# EAGLE design Pinduino-Nano-Sys11b (EAGLE 7.7.0)
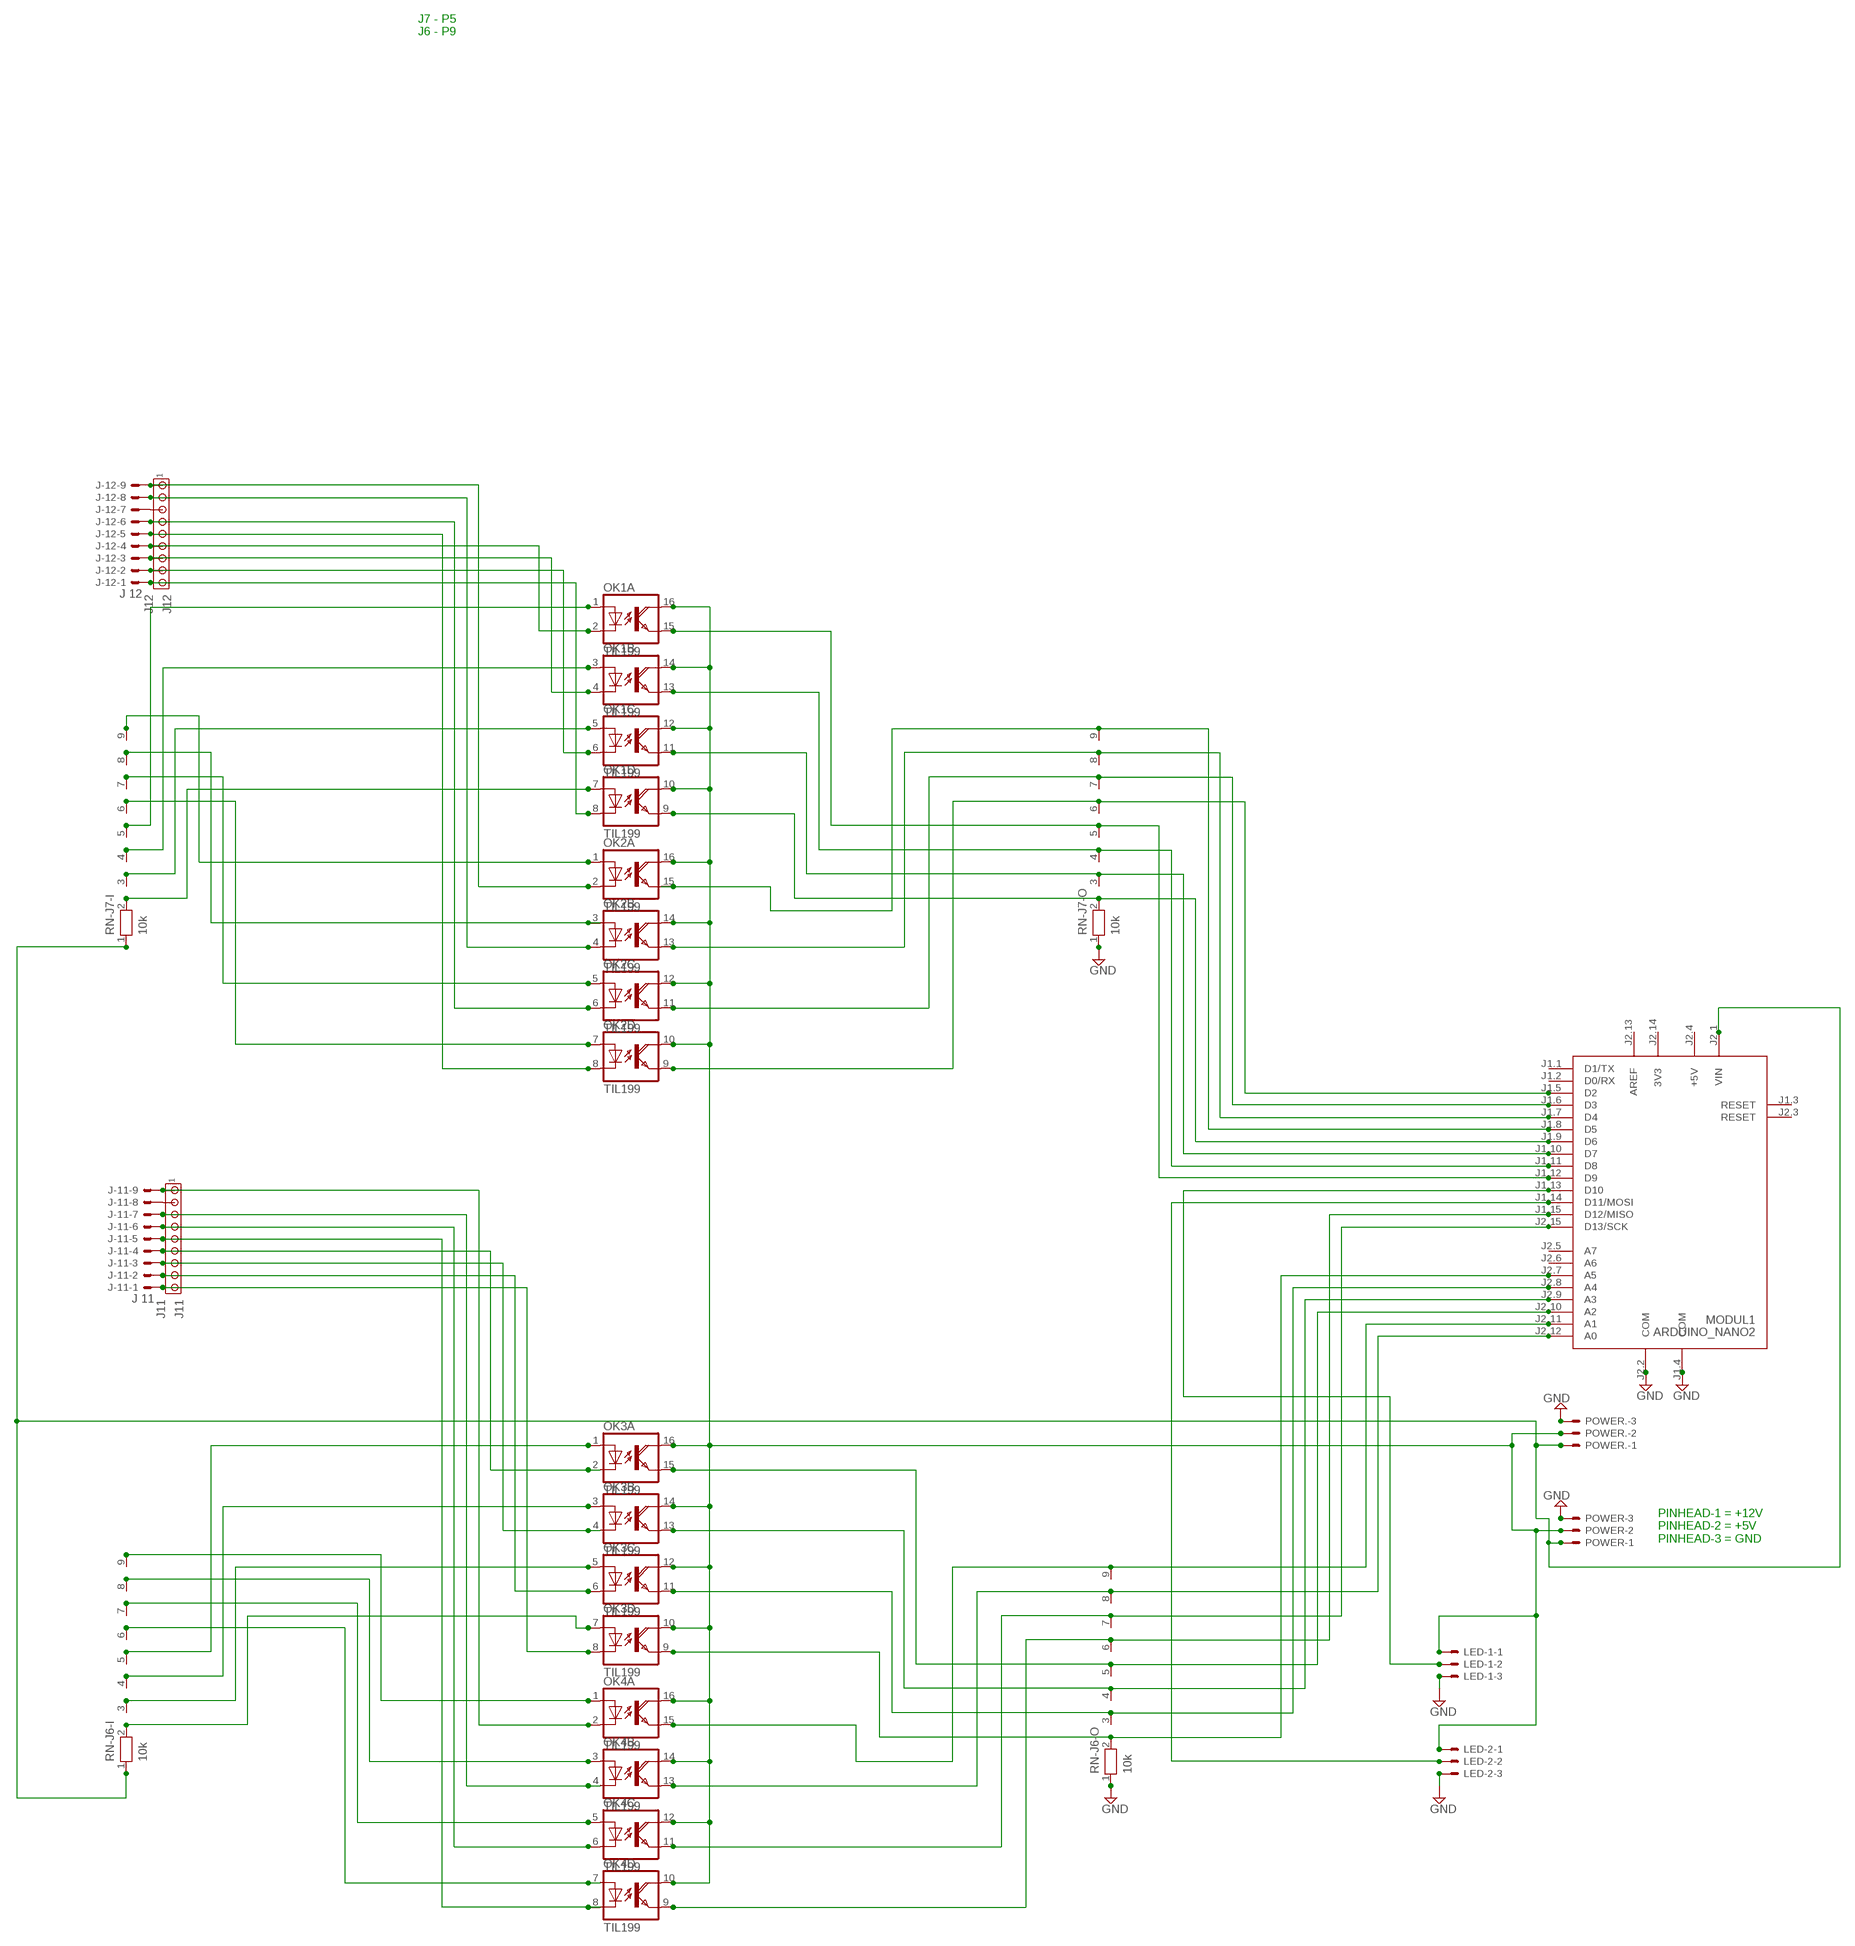
[diagram p0: schematic, sheet 1]

## Parts
J11  J11  MTA09-156  [1X9MTA]
J12  J12  MTA09-156  [1X9MTA]
J-11  J 11  KK-156-9  [KK-156-9]
J-12  J 12  KK-156-9  [KK-156-9]
LED-1  22-23-2031  [22-23-2031]
LED-2  22-23-2031  [22-23-2031]
MODUL1  ARDUINO_NANO2  [ARDUINO_NANO2]
OK1  TIL199  [DIL16]
OK2  TIL199  [DIL16]
OK3  TIL199  [DIL16]
OK4  TIL199  [DIL16]
POWER  22-23-2031  [22-23-2031]
POWER.  22-23-2031  [22-23-2031]
RN-J6-I  10k  RN08  [RN-9]
RN-J6-O  10k  RN08  [RN-9]
RN-J7-I  10k  RN08  [RN-9]
RN-J7-O  10k  RN08  [RN-9]

## Nets
ARD+5V [Power]: LED-1.1 LED-2.1 OK1.10(D:COL) OK1.12(C:COL) OK1.14(B:COL) OK1.16(A:COL) OK2.10(D:COL) OK2.12(C:COL) OK2.14(B:COL) OK2.16(A:COL) OK3.10(D:COL) OK3.12(C:COL) OK3.14(B:COL) OK3.16(A:COL) OK4.10(D:COL) OK4.12(C:COL) OK4.14(B:COL) OK4.16(A:COL) POWER.2 POWER..2
GND: LED-1.3 LED-2.3 MODUL1.J1.4(COM) MODUL1.J2.2(COM) POWER.3 POWER..3 RN-J6-O.1 RN-J7-O.1
N$1: J12.6 J-12.4 OK1.2(A:C)
N$2: MODUL1.J1.9(D6) OK1.9(D:EMI) RN-J7-O.2
N$3: OK1.3(B:A) RN-J7-I.4
N$4: OK1.5(C:A) RN-J7-I.3
N$5: OK1.7(D:A) RN-J7-I.2
N$6: OK2.1(A:A) RN-J7-I.9
N$7: OK2.3(B:A) RN-J7-I.8
N$8: OK2.5(C:A) RN-J7-I.7
N$9: OK1.1(A:A) RN-J7-I.5
N$10: J12.9 J-12.1 OK1.8(D:C)
N$11: J12.8 J-12.2 OK1.6(C:C)
N$12: J12.7 J-12.3 OK1.4(B:C)
N$13: OK2.7(D:A) RN-J7-I.6
N$14: J12.5 J-12.5 OK2.8(D:C)
N$15: J11.9 J-11.1 OK3.8(D:C)
N$16: J12.2 J-12.8 OK2.4(B:C)
N$17: J12.1 J-12.9 OK2.2(A:C)
N$18: MODUL1.J1.10(D7) OK1.11(C:EMI) RN-J7-O.3
N$19: J11.7 J-11.3 OK3.4(B:C)
N$20: J11.5 J-11.5 OK4.8(D:C)
N$21: J11.4 J-11.6 OK4.6(C:C)
N$22: J11.3 J-11.7 OK4.4(B:C)
N$23: J12.3 J-12.7
N$25: J11.2 J-11.8
N$26: MODUL1.J2.11(A1) OK4.15(A:EMI) RN-J6-O.9
N$27: J11.1 J-11.9 OK4.2(A:C)
N$29: OK4.1(A:A) RN-J6-I.9
N$30: OK4.3(B:A) RN-J6-I.8
N$31: OK4.5(C:A) RN-J6-I.7
N$32: OK3.3(B:A) RN-J6-I.4
N$33: OK3.1(A:A) RN-J6-I.5
N$34: OK3.5(C:A) RN-J6-I.3
N$35: OK4.7(D:A) RN-J6-I.6
N$37: OK3.7(D:A) RN-J6-I.2
N$38: MODUL1.J1.8(D5) OK2.15(A:EMI) RN-J7-O.9
N$39: MODUL1.J1.11(D8) OK1.13(B:EMI) RN-J7-O.4
N$40: J11.8 J-11.2 OK3.6(C:C)
N$41: MODUL1.J1.12(D9) OK1.15(A:EMI) RN-J7-O.5
N$42: MODUL1.J2.9(A3) OK3.13(B:EMI) RN-J6-O.4
N$43: MODUL1.J1.5(D2) OK2.9(D:EMI) RN-J7-O.6
N$44: LED-2.2 MODUL1.J1.14(D11/MOSI)
N$45: LED-1.2 MODUL1.J1.13(D10)
N$47: J12.4 J-12.6 OK2.6(C:C)
N$48: J11.6 J-11.4 OK3.2(A:C)
N$50: MODUL1.J2.15(D13/SCK) OK4.11(C:EMI) RN-J6-O.7
N$52: MODUL1.J1.15(D12/MISO) OK4.9(D:EMI) RN-J6-O.6
N$53: MODUL1.J2.10(A2) OK3.15(A:EMI) RN-J6-O.5
N$55: MODUL1.J2.12(A0) OK4.13(B:EMI) RN-J6-O.8
N$56: MODUL1.J1.6(D3) OK2.11(C:EMI) RN-J7-O.7
N$57: MODUL1.J1.7(D4) OK2.13(B:EMI) RN-J7-O.8
N$58: MODUL1.J2.8(A4) OK3.11(C:EMI) RN-J6-O.3
N$59: MODUL1.J2.7(A5) OK3.9(D:EMI) RN-J6-O.2
N$61 [GND]: MODUL1.J2.1(VIN) POWER.1 POWER..1 RN-J6-I.1 RN-J7-I.1
Unconnected: MODUL1.J1.1(D1/TX) MODUL1.J1.2(D0/RX) MODUL1.J1.3(RESET) MODUL1.J2.3(RESET) MODUL1.J2.5(A7) MODUL1.J2.6(A6)

## Notes on the sheet
- J7 - P5
  J6 - P9
- PINHEAD-1 = +12V
  PINHEAD-2 = +5V
  PINHEAD-3 = GND

## Power pins joined to a net without a drawn wire
3V3: MODUL1.J2.14(3V3)
+5V: MODUL1.J2.4(+5V)
AREF: MODUL1.J2.13(AREF)

## Library data of the parts
J11 J12 = con-amp:MTA09-156: AMP connector
J-11 J-12 = con-molex:KK-156-9: KK 156 HEADER Source: http://www.molex.com/pdm_docs/sd/026604100_sd.pdf; OC_FARNELL: unknown; OC_NEWARK: unknown
LED-1 LED-2 POWER POWER. = con-molex:22-23-2031: .100" (2.54mm) Center Header - 3 Pin; MF: MOLEX; MPN: 22-23-2031; OC_FARNELL: 1462950; OC_NEWARK: 30C0862
MODUL1 = arduino:ARDUINO_NANO2: Arduino Nano2 Auto generated by modulcreator.ulp \;; ANZAHL: 2; MODUL: TRUE; STECKX0: -76200; STECKX1: 76200; STECKY0: 177800; STECKY1: 177800
OK1-OK4 = optocoupler:TIL199: TEXAS INSTRUMENTS OPTO COUPLER; MPN: TIL 199; OC_FARNELL: 1683370; OC_NEWARK: 05R6483
RN-J6-I RN-J6-O RN-J7-I RN-J7-O = resistor-net:RN08: RESISTOR NETWORK; OC_FARNELL: unknown; OC_NEWARK: unknown

## Net classes
0 default: width 0.406 mm
1 Power: width 0.61 mm
2 GND: width 0.61 mm

## Board
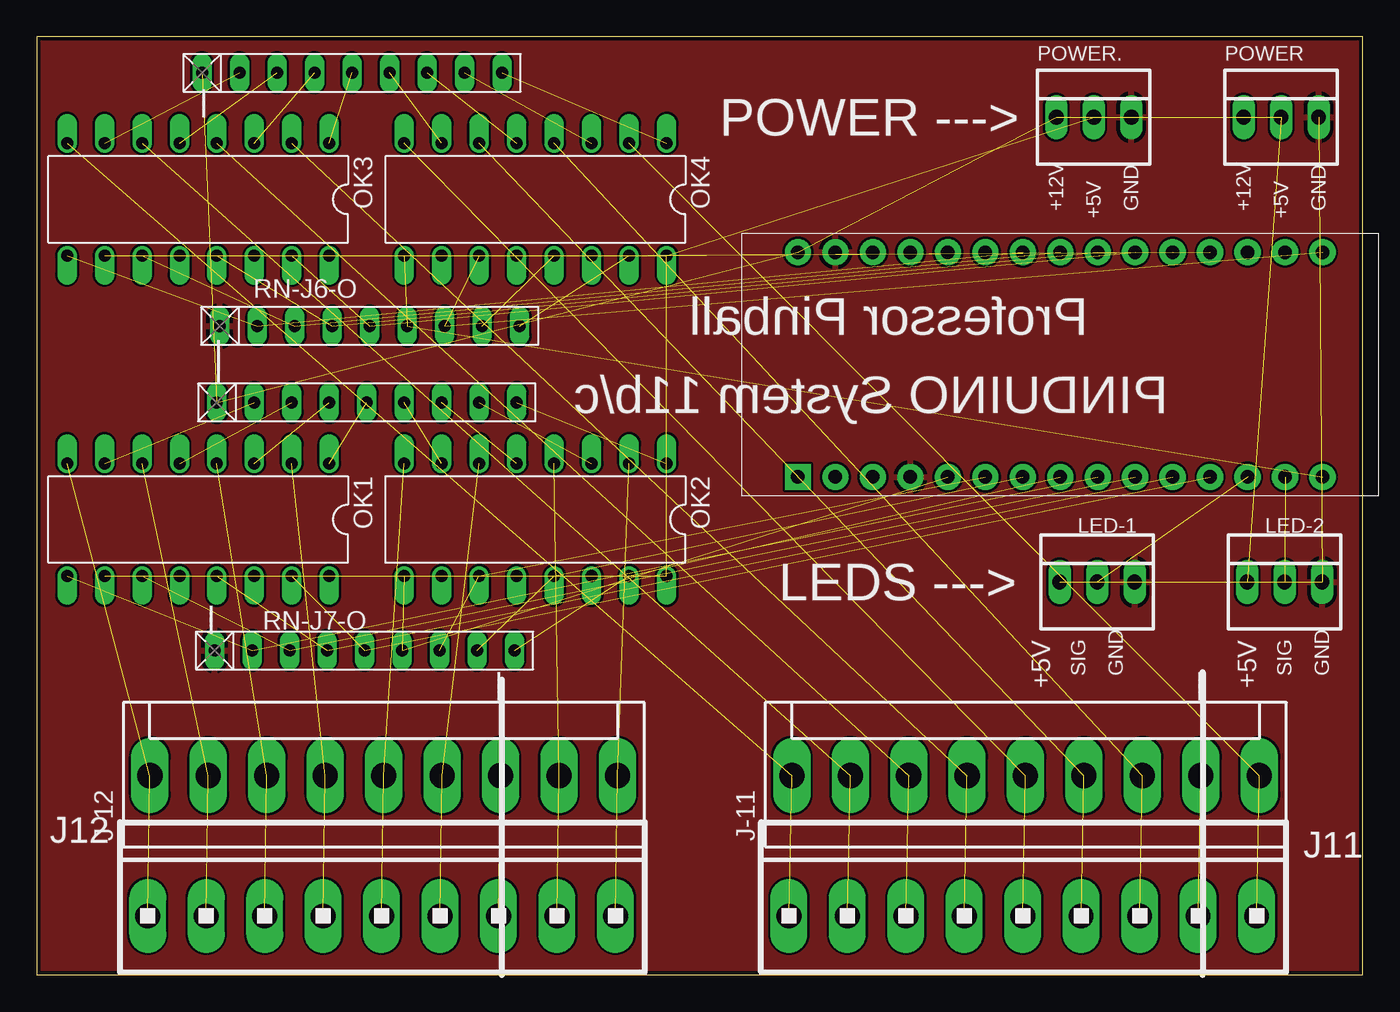
[diagram p1: board, top side]
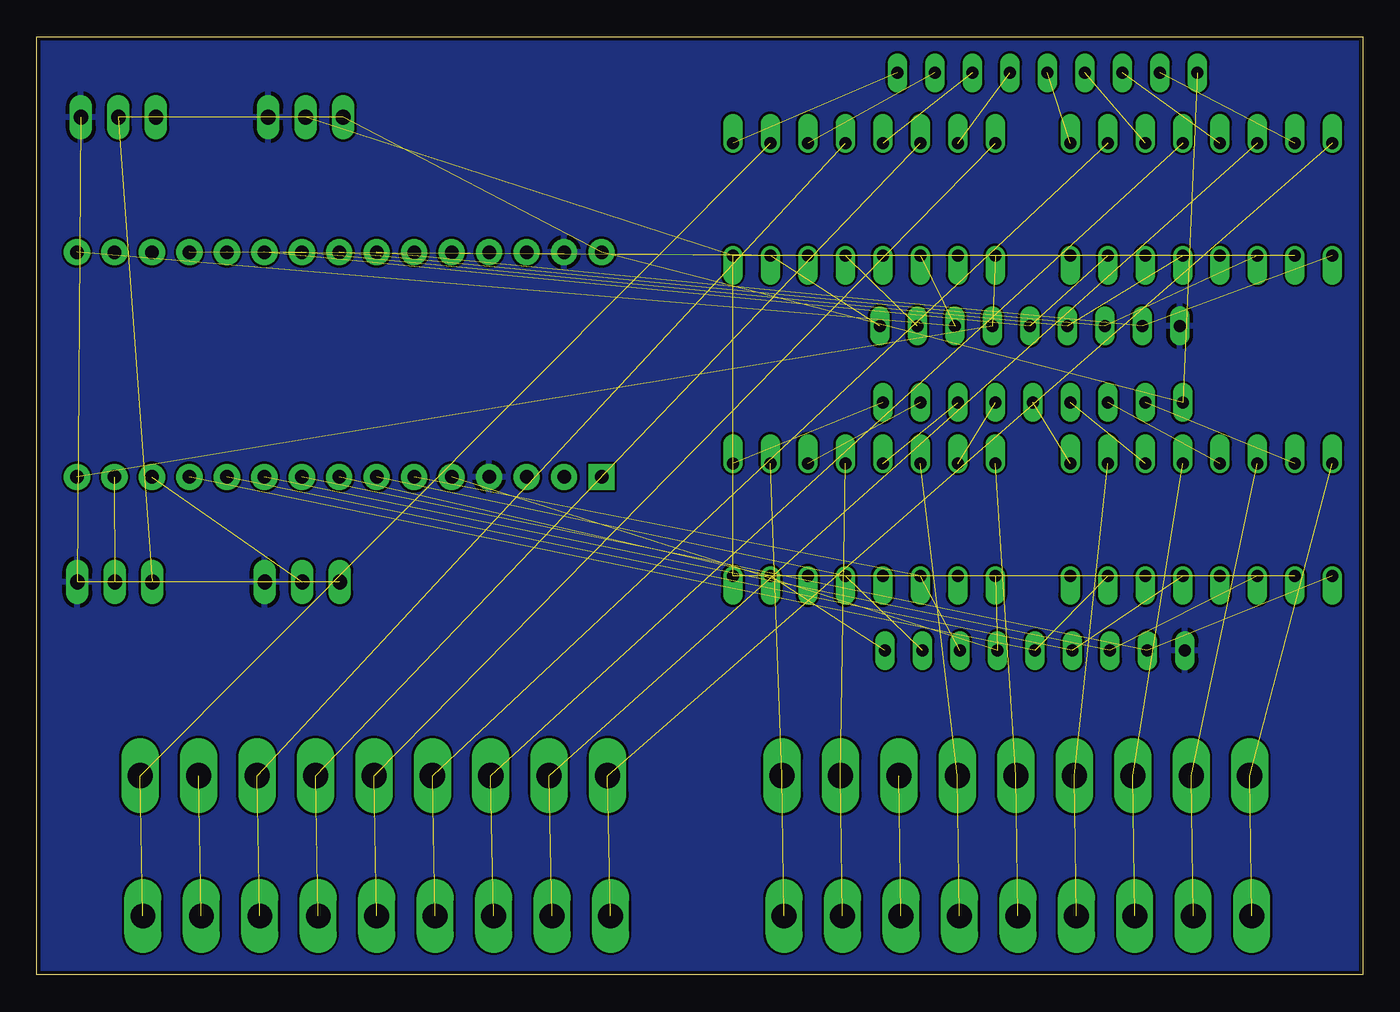
[diagram p2: board, bottom side, seen from below]

Size 89.84 x 63.57 mm. Coordinates in mm from the lower left corner, seen from the top.
Outline: 0,0 89.84,0 89.84,63.57 0,63.57 0,0
Copper layers (1*16): Top 0.035mm / dielectric 1.5mm / Bottom 0.035mm
Design rules "SeeedStudio_2layer_DRU_no_angle_20140221": minimum track width 6mil, minimum drill 12mil, track to track 6mil, track to pad 6mil, pad to pad 6mil, via to via 6mil, smd to smd 0mil, copper to edge 10mil, drill to drill 10mil, minimum pad ring 10mil, minimum via ring 6mil, stop-mask expansion 2mil, vias tented up to drill 100mil, thermal gap 10mil

### Footprints (pad centres in the part's own frame; a part is rotated, then mirrored left to right if it is on the bottom)
1X9MTA = drill 1.676 long: 1 15.85,0; 2 11.887,0; 3 7.925,0; 4 3.962,0; 5 0,0; 6 -3.962,0; 7 -7.925,0; 8 -11.887,0; 9 -15.85,0
KK-156-9 = drill 1.7 pad 2.184 long: 1 -15.84,0; 2 -11.88,0; 3 -7.92,0; 4 -3.96,0; 5 0,0; 6 3.96,0; 7 7.92,0; 8 11.88,0; 9 15.84,0
22-23-2031 = drill 1 long: 1 -2.54,0; 2 0,0; 3 2.54,0
ARDUINO_NANO2 = drill 0.914 pad 1.778 square: J1.1 -7.62,17.78 | drill 0.914 pad 1.778: J1.2 -7.62,15.24; J1.3 -7.62,12.7; J1.4 -7.62,10.16; J1.5 -7.62,7.62; J1.6 -7.62,5.08; J1.7 -7.62,2.54; J1.8 -7.62,0; J1.9 -7.62,-2.54; J1.10 -7.62,-5.08; J1.11 -7.62,-7.62; J1.12 -7.62,-10.16; J1.13 -7.62,-12.7; J1.14 -7.62,-15.24; J1.15 -7.62,-17.78; J2.1 7.62,17.78; J2.2 7.62,15.24; J2.3 7.62,12.7; J2.4 7.62,10.16; J2.5 7.62,7.62; J2.6 7.62,5.08; J2.7 7.62,2.54; J2.8 7.62,0; J2.9 7.62,-2.54; J2.10 7.62,-5.08; J2.11 7.62,-7.62; J2.12 7.62,-10.16; J2.13 7.62,-12.7; J2.14 7.62,-15.24; J2.15 7.62,-17.78
DIL16 = drill 0.813 offset: 1 -8.89,-3.81; 2 -6.35,-3.81; 3 -3.81,-3.81; 4 -1.27,-3.81; 5 1.27,-3.81; 6 3.81,-3.81; 7 6.35,-3.81; 8 8.89,-3.81; 9 8.89,3.81; 10 6.35,3.81; 11 3.81,3.81; 12 1.27,3.81; 13 -1.27,3.81; 14 -3.81,3.81; 15 -6.35,3.81; 16 -8.89,3.81
RN-9 = drill 0.813 long: 1 -10.16,0; 2 -7.62,0; 3 -5.08,0; 4 -2.54,0; 5 0,0; 6 2.54,0; 7 5.08,0; 8 7.62,0; 9 10.16,0

### Placement (x,y rotation side)
J11  66.81,3.99 0 top
J12  23.36,3.99 0 top
J-11  67,13.5 0 top
J-12  23.5,13.5 0 top
LED-1  71.85,26.62 0 top
LED-2  84.55,26.62 0 top
MODUL1  69.35,41.36 90 top
OK1  10.93,30.86 180 top
OK2  33.79,30.86 180 top
OK3  10.93,52.56 180 top
OK4  33.79,52.56 180 top
POWER  84.32,58.12 0 top
POWER.  71.62,58.12 0 top
RN-J6-I  21.35,61.14 0 top
RN-J6-O  22.56,43.97 0 top
RN-J7-I  22.35,38.79 0 top
RN-J7-O  22.2,21.97 0 top

### Tracks (layer width: path | path; a pad name or v marks a point on that pad's centre or on a via)
ARD+5V  (19 unrouted)
GND  (2 unrouted)
  pour Top: -1.27,64.77 -1.27,-2.54 92.71,-2.54 92.71,64.77
  pour Bottom: -2.54,66.04 -2.54,-1.27 91.44,-1.27 91.44,66.04
N$1  (2 unrouted)
N$2  (2 unrouted)
N$3  (1 unrouted)
N$4  (1 unrouted)
N$5  (1 unrouted)
N$6  (1 unrouted)
N$7  (1 unrouted)
N$8  (1 unrouted)
N$9  (1 unrouted)
N$10  (2 unrouted)
N$11  (2 unrouted)
N$12  (2 unrouted)
N$13  (1 unrouted)
N$14  (2 unrouted)
N$15  (2 unrouted)
N$16  (2 unrouted)
N$17  (2 unrouted)
N$18  (2 unrouted)
N$19  (2 unrouted)
N$20  (2 unrouted)
N$21  (2 unrouted)
N$22  (2 unrouted)
N$23  (1 unrouted)
N$25  (1 unrouted)
N$26  (2 unrouted)
N$27  (2 unrouted)
N$29  (1 unrouted)
N$30  (1 unrouted)
N$31  (1 unrouted)
N$32  (1 unrouted)
N$33  (1 unrouted)
N$34  (1 unrouted)
N$35  (1 unrouted)
N$37  (1 unrouted)
N$38  (2 unrouted)
N$39  (2 unrouted)
N$40  (2 unrouted)
N$41  (2 unrouted)
N$42  (2 unrouted)
N$43  (2 unrouted)
N$44  (1 unrouted)
N$45  (1 unrouted)
N$47  (2 unrouted)
N$48  (2 unrouted)
N$50  (2 unrouted)
N$52  (2 unrouted)
N$53  (2 unrouted)
N$55  (2 unrouted)
N$56  (2 unrouted)
N$57  (2 unrouted)
N$58  (2 unrouted)
N$59  (2 unrouted)
N$61  (4 unrouted)

### Text on the board
tNames: -- | -- | POWER ---> | +5V | +5V | +12V | GND | +12V | GND | Professor Pinball | -- | -- | -- | -- | PINDUINO System 11b/c | LEDS ---> | -- | -- | +5V | +5V | SIG | GND | SIG | GND | -- | -- | -- | --